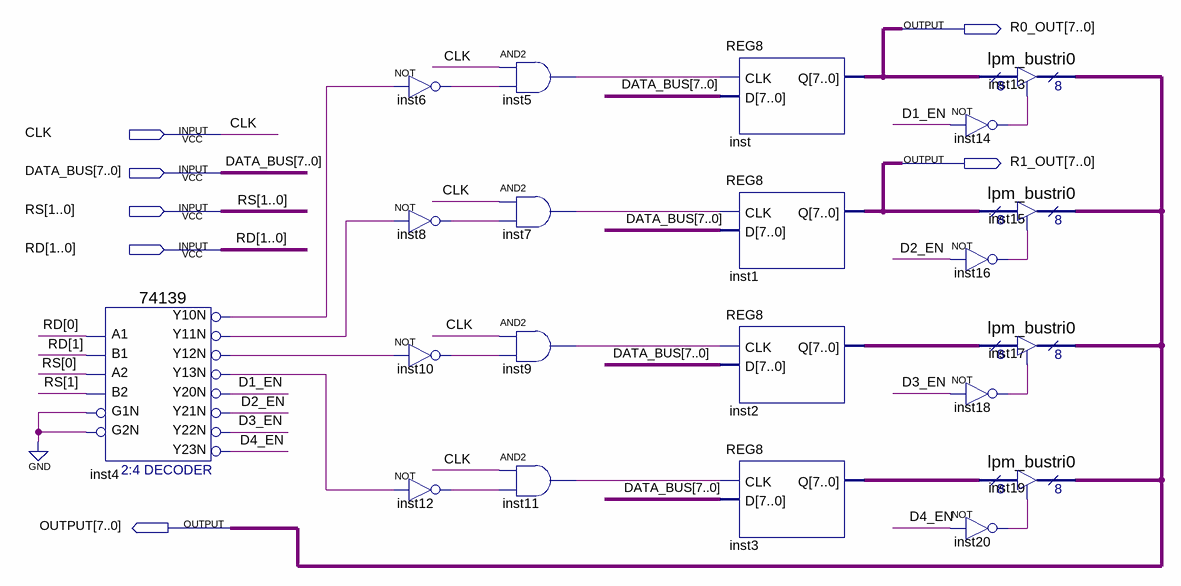
[diagram p0: schematic sheet]
// Quartus schematic REG_STACK_8X4.bdf as structural Verilog: 21 symbols, 7 pins
module REG_STACK_8X4 (
  input  CLK,
  input  [7:0] DATA_BUS,
  input  [1:0] RS,
  input  [1:0] RD,
  output [7:0] R0_OUT,
  output [7:0] R1_OUT,
  output [7:0] OUTPUT
);

  wire D1_EN, D2_EN, D3_EN, D4_EN, inst4_y10n, inst4_y11n, inst4_y12n, inst4_y13n, inst5_out, inst6_out,
       inst7_out, inst8_out, inst9_out, inst10_out, inst11_out, inst12_out, inst14_out, inst16_out,
       inst18_out, inst20_out;
  wire [7:0] inst2_q, inst3_q;

  \74139  inst4 (
    .A1(RD[0]), .A2(RS[0]), .B1(RD[1]), .B2(RS[1]), .G1N(1'b0), .G2N(1'b0), .Y10N(inst4_y10n), .Y20N(D1_EN),
    .Y13N(inst4_y13n), .Y12N(inst4_y12n), .Y11N(inst4_y11n), .Y21N(D2_EN), .Y22N(D3_EN), .Y23N(D4_EN));
  not inst6 (inst6_out, inst4_y10n);
  not inst8 (inst8_out, inst4_y11n);
  not inst10 (inst10_out, inst4_y12n);
  not inst12 (inst12_out, inst4_y13n);
  and inst5 (inst5_out, CLK, inst6_out);
  and inst7 (inst7_out, CLK, inst8_out);
  and inst9 (inst9_out, CLK, inst10_out);
  and inst11 (inst11_out, CLK, inst12_out);
  REG8 inst (.CLK(inst5_out), .D(DATA_BUS), .Q(R0_OUT));
  REG8 inst1 (.CLK(inst7_out), .D(DATA_BUS), .Q(R1_OUT));
  REG8 inst2 (.CLK(inst9_out), .D(DATA_BUS), .Q(inst2_q));
  REG8 inst3 (.CLK(inst11_out), .D(DATA_BUS), .Q(inst3_q));
  not inst14 (inst14_out, D1_EN);
  not inst16 (inst16_out, D2_EN);
  not inst18 (inst18_out, D3_EN);
  not inst20 (inst20_out, D4_EN);
  lpm_bustri0 inst13 (.enabledt(inst14_out), .data(R0_OUT), .tridata(OUTPUT));
  lpm_bustri0 inst15 (.enabledt(inst16_out), .data(R1_OUT), .tridata(OUTPUT));
  lpm_bustri0 inst17 (.enabledt(inst18_out), .data(inst2_q), .tridata(OUTPUT));
  lpm_bustri0 inst19 (.enabledt(inst20_out), .data(inst3_q), .tridata(OUTPUT));
endmodule
